# EAGLE design module_r2 (EAGLE 5.11)
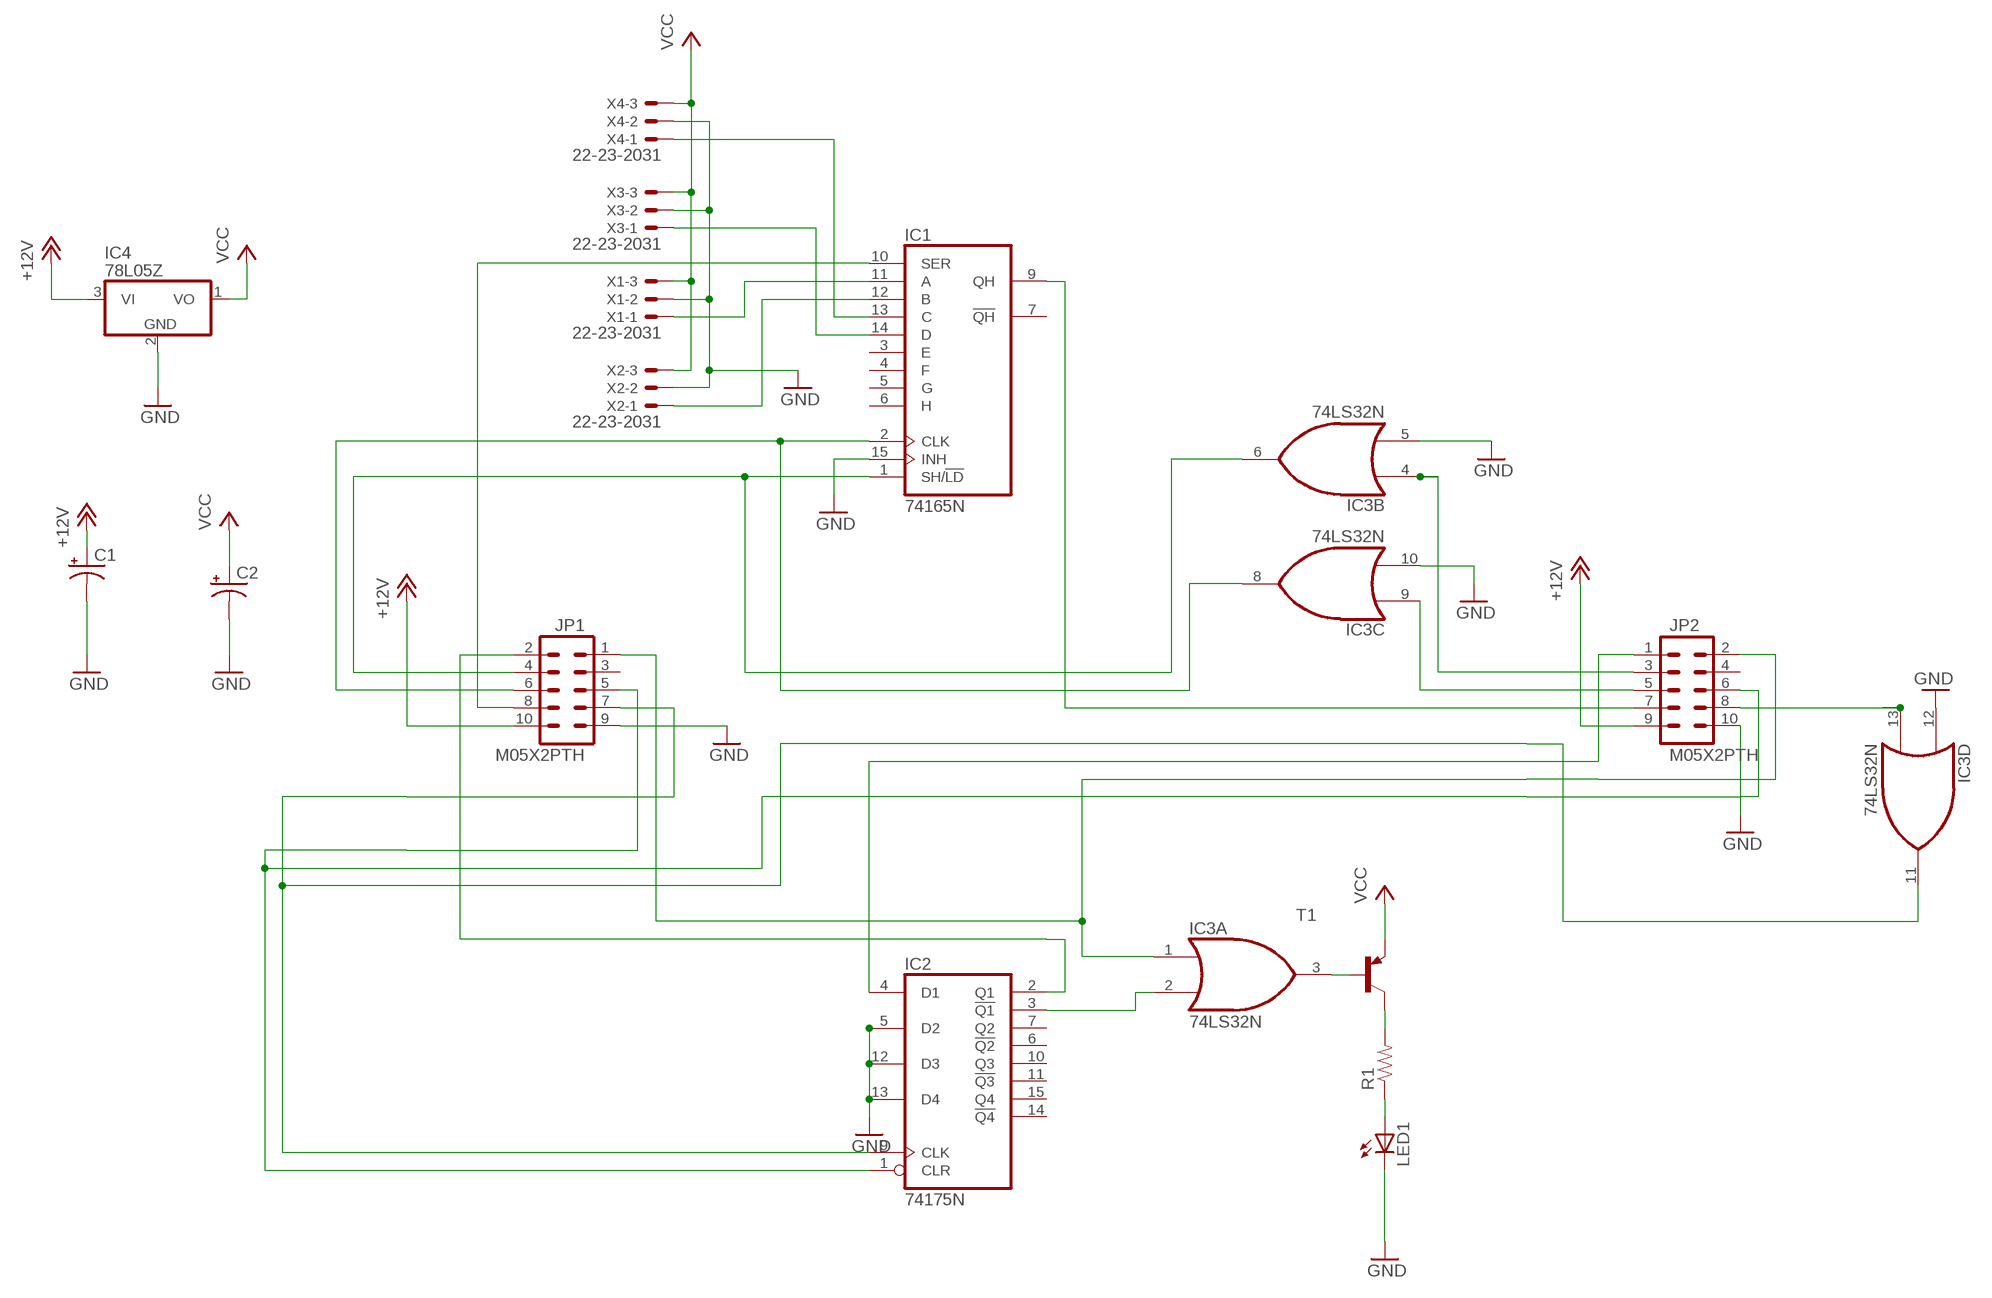
[diagram p0: schematic, sheet 1]

## Parts
C1  CAP_POLPTH2  [CPOL-RADIAL-10UF-25V]
C2  CAP_POLPTH2  [CPOL-RADIAL-10UF-25V]
IC1  74165N  [DIL16]
IC2  74175N  [DIL16]
IC3  74LS32N  [DIL14]
IC4  78L05Z  [TO92]
JP1  M05X2PTH  [AVR_ICSP]
JP2  M05X2PTH  [AVR_ICSP]
LED1  LEDSFH480  [SFH480]
R1  RESISTORPTH-1/6W  [1/6W-RES]
T1  2N3906-PNP-TO92-EBC  [TO92-EBC]
X1  22-23-2031  [22-23-2031]
X2  22-23-2031  [22-23-2031]
X3  22-23-2031  [22-23-2031]
X4  22-23-2031  [22-23-2031]

## Nets
+12V: C1.1(+) IC4.3(VI) JP1.10 JP2.9
GND: C1.2(-) C2.2(-) IC1.15(INH) IC2.5(D2) IC2.12(D3) IC2.13(D4) IC3.5(B:I1) IC3.10(C:I1) IC3.12(D:I0) IC4.2(GND) JP1.9 JP2.10 LED1.K(C) X1.2 X2.2 X3.2 X4.2
N$1: R1.2 T1.C
N$2: IC1.1(SH/!LD) IC3.6(B:O) JP1.4
N$3: IC1.9(QH) JP2.7
N$4: IC1.2(CLK) IC3.8(C:O) JP1.6
N$5: IC3.1(A:I0) JP1.1 JP2.2
N$6: IC3.3(A:O) T1.B
N$7: LED1.A R1.1
N$8: IC1.10(SER) JP1.8
N$9: IC2.1(CLR) JP1.5 JP2.6
N$10: IC2.9(CLK) IC3.11(D:O) JP1.7
N$11: IC1.13(C) X4.1
N$12: IC2.4(D1) JP2.1
N$13: IC1.14(D) X3.1
N$14: IC1.11(A) X1.1
N$15: IC1.12(B) X2.1
N$16: IC2.2(Q1) JP1.2
N$17: IC2.3(!Q1) IC3.2(A:I1)
N$18: IC3.4(B:I0) JP2.3
N$19: IC3.9(C:I0) JP2.5
N$20: IC3.13(D:I1) JP2.8
VCC: C2.1(+) IC4.1(VO) T1.E X1.3 X2.3 X3.3 X4.3
Unconnected: IC1.3(E) IC1.4(F) IC1.5(G) IC1.6(H) IC1.7(!QH) IC2.6(!Q2) IC2.7(Q2) IC2.10(Q3) IC2.11(!Q3) IC2.14(!Q4) IC2.15(Q4) JP1.3 JP2.4

## Power pins joined to a net without a drawn wire
GND: IC1.8(GND) IC2.8(GND) IC3.7(P:GND)
VCC: IC1.16(VCC) IC2.16(VCC) IC3.14(P:VCC)

## Library data of the parts
C1 C2 = SparkFun:CAP_POL: Capacitor Polarized These are standard SMD and PTH capacitors. Normally 10uF, 47uF, and 100uF in electrolytic and tantalum varieties. Always verify the external diameter of the through hole cap, it varies with capacity, voltage, and manufacturer. The EIA devices should be standard.
IC1 = 74xx-us:74*165: 8-bit parallel load SHIFT REGISTER
IC2 = 74xx-us:74*175: Qadruple D type FLIP FLOP, clear
IC3 = 74xx-us:74*32: Quad 2-input OR gate
IC4 = linear:78*: Positive VOLTAGE REGULATOR Source: http://cache.national.com/ds/LM/LM78L05.pdf http://www.fairchildsemi.com/ds/LM/LM7805.pdf
JP1 JP2 = SparkFun:M05X2: Header 5x2 Standard 10-pin dual row 0.1" header. Commonly used with AVR-ISP. Use with Spark Fun Electronics SKU: PRT-00778
LED1 = led:LED: LED OSRAM: - CHIPLED LG R971, LG N971, LY N971, LG Q971, LY Q971, LO R971, LY R971 LH N974, LH R974 LS Q976, LO Q976, LY Q976 LO Q996 - Hyper CHIPLED LW Q18S LB Q993, LB Q99A, LB R99A - SideLED LS A670, LO A670, LY A670, LG A670, LP A670 LB A673, LV A673, LT A673, LW A673 LH A674 LY A675 LS A676, LA A676, LO A676, LY A676, LW A676 LS A679, LY A679, LG A679 - Hyper Micro SIDELED® LS Y876, LA Y876, LO Y876, LY Y876 LT Y87S - SmartLED LW L88C, LW L88S LB L89C, LB L89S, LG L890 LS L89K, LO L89K, LY L89K LS L896, LA L896, LO L896, LY L896 - TOPLED LS T670, LO T670, LY T670, LG T670, LP T670 LSG T670, LSP T670, LSY T670, LOP T670, LYG T670 LG T671, LOG T671, LSG T671 LB T673, LV T673, LT T673, LW T673 LH T674 LS T676, LA T676, LO T676, LY T676, LB T676, LH T676, LSB T676, LW T676 LB T67C, LV T67C, LT T67C, LS T67K, LO T67K, LY T67K, LW E67C LS E67B, LA E67B, LO E67B, LY E67B, LB E67C, LV E67C, LT E67C LW T67C LS T679, LY T679, LG T679 LS T770, LO T770, LY T770, LG T770, LP T770 LB T773, LV T773, LT T773, LW T773 LH T774 LS E675, LA E675, LY E675, LS T675 LS T776, LA T776, LO T776, LY T776, LB T776 LHGB T686 LT T68C, LB T68C - Hyper Mini TOPLED® LB M676 - Mini TOPLED Santana® LG M470 LS M47K, LO M47K, LY M47K Source: http://www.osram.convergy.de LUXEON: - LUMILED® LXK2-PW12-R00, LXK2-PW12-S00, LXK2-PW14-U00, LXK2-PW14-V00 LXK2-PM12-R00, LXK2-PM12-S00, LXK2-PM14-U00 LXK2-PE12-Q00, LXK2-PE12-R00, LXK2-PE12-S00, LXK2-PE14-T00, LXK2-PE14-U00 LXK2-PB12-K00, LXK2-PB12-L00, LXK2-PB12-M00, LXK2-PB14-N00, LXK2-PB14-P00, LXK2-PB14-Q00 LXK2-PR12-L00, LXK2-PR12-M00, LXK2-PR14-Q00, LXK2-PR14-R00 LXK2-PD12-Q00, LXK2-PD12-R00, LXK2-PD12-S00 LXK2-PH12-R00, LXK2-PH12-S00 LXK2-PL12-P00, LXK2-PL12-Q00, LXK2-PL12-R00 Source: www.luxeon.com KINGBRIGHT: KA-3528ASYC Source: www.kingbright.com
R1 = SparkFun:RESISTOR: Resistor Basic schematic elements and footprints for 0603, 1206, and PTH 1/10th watt (small) resistors.
T1 = transistor-neu-to92:*-PNP-: PNP Transistror
X1-X4 = con-molex:22-23-2031: .100" (2.54mm) Center Header - 3 Pin; MF: MOLEX; MPN: 22-23-2031; OC_FARNELL: 1462950; OC_NEWARK: 30C0862

## Board
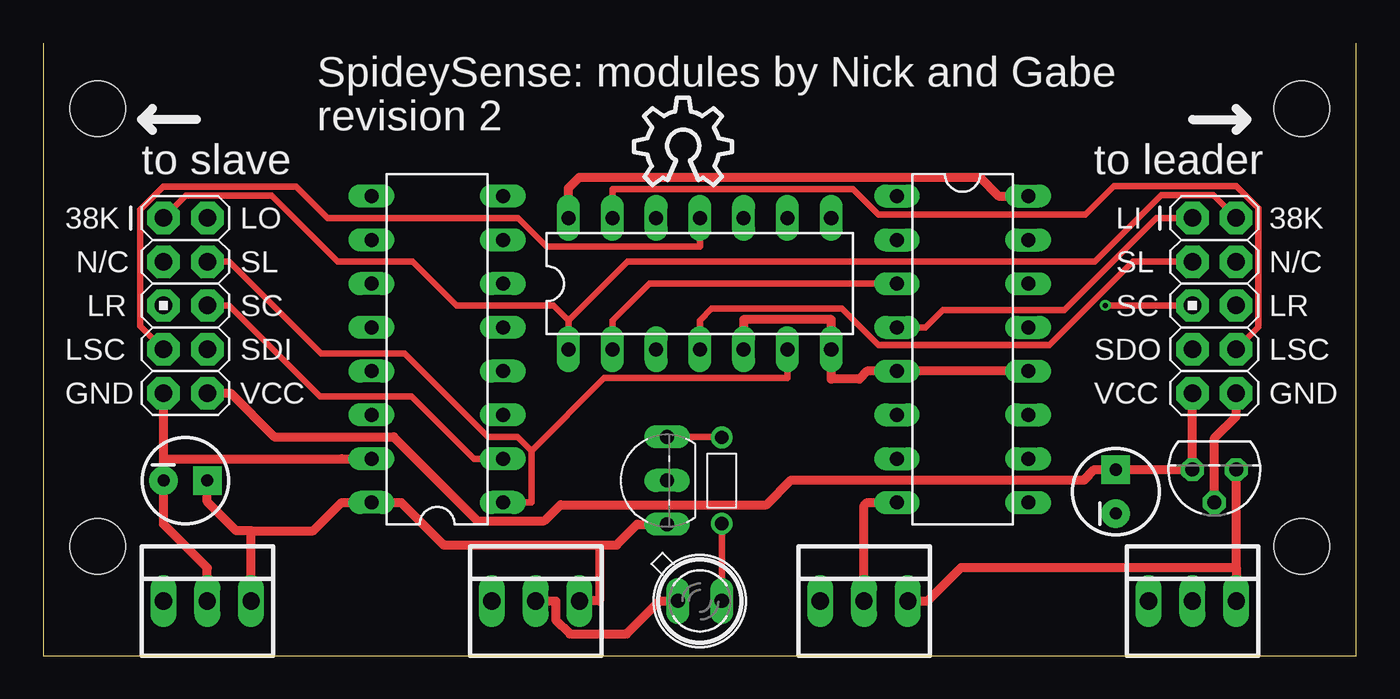
[diagram p1: board, top side]
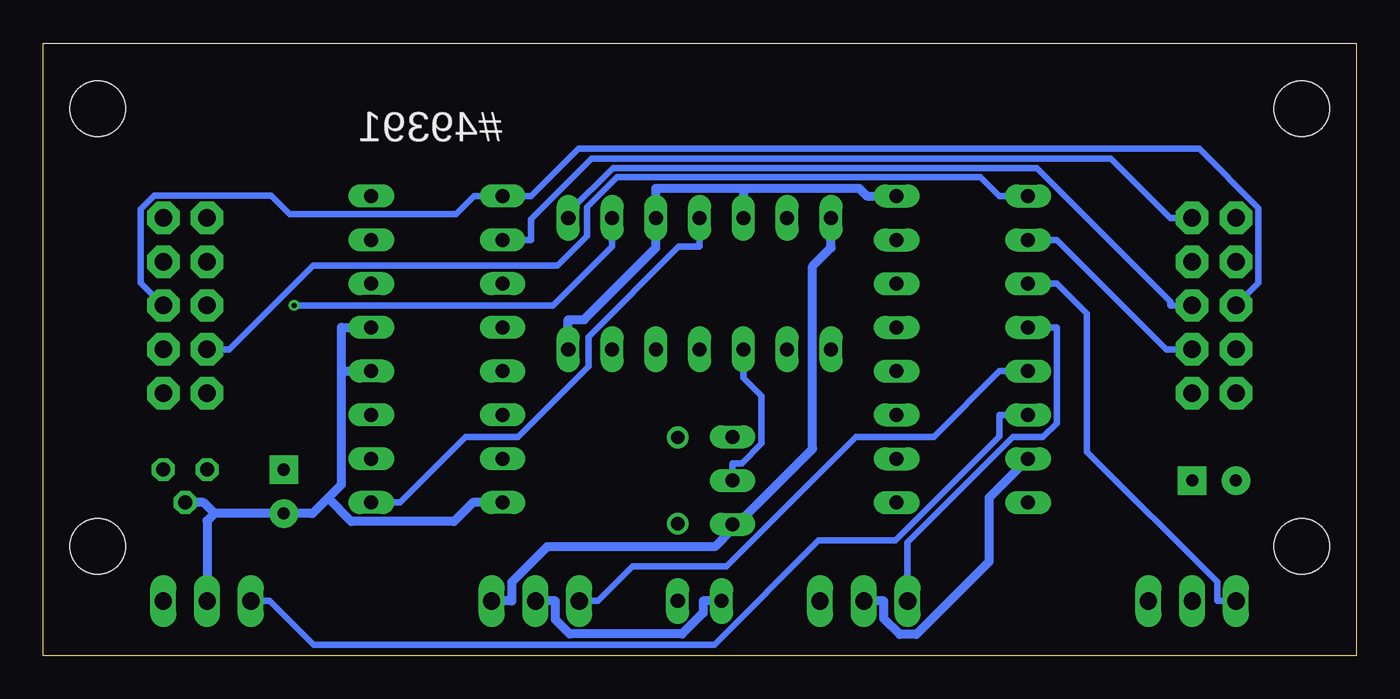
[diagram p2: board, bottom side, seen from below]

Size 76.19 x 35.55 mm. Coordinates in mm from the lower left corner, seen from the top.
Outline: 76.19,35.55 76.19,0 0,0 0,35.55
Copper layers (1*16): Top 0.035mm / dielectric 1.5mm / Bottom 0.035mm
Design rules "Fusion_eagle_rule_v1.1": minimum track width 6mil, minimum drill 12mil, track to track 6mil, track to pad 6mil, pad to pad 6mil, via to via 6mil, smd to smd 0mil, copper to edge 10mil, drill to drill 10mil, minimum pad ring 10mil, minimum via ring 6mil, stop-mask expansion 2mil, vias tented up to drill 100mil, thermal gap 10mil
Holes 3.2 mm at 3.17,6.35 3.17,31.75 73.03,31.75 73.03,6.35

### Footprints (pad centres in the part's own frame; a part is rotated, then mirrored left to right if it is on the bottom)
CPOL-RADIAL-10UF-25V = drill 0.7 pad 1.651 square: 1 1.27,0 | drill 0.7 pad 1.651 round: 2 -1.27,0
DIL16 = drill 0.813 long: 1 -8.89,-3.81; 2 -6.35,-3.81; 3 -3.81,-3.81; 4 -1.27,-3.81; 5 1.27,-3.81; 6 3.81,-3.81; 7 6.35,-3.81; 8 8.89,-3.81; 9 8.89,3.81; 10 6.35,3.81; 11 3.81,3.81; 12 1.27,3.81; 13 -1.27,3.81; 14 -3.81,3.81; 15 -6.35,3.81; 16 -8.89,3.81
DIL14 = drill 0.813 long: 1 -7.62,-3.81; 2 -5.08,-3.81; 3 -2.54,-3.81; 4 0,-3.81; 5 2.54,-3.81; 6 5.08,-3.81; 7 7.62,-3.81; 8 7.62,3.81; 9 5.08,3.81; 10 2.54,3.81; 11 0,3.81; 12 -2.54,3.81; 13 -5.08,3.81; 14 -7.62,3.81
TO92 = drill 0.813 octagon: 1 -1.27,0; 2 0,1.905; 3 1.27,0
AVR_ICSP = drill 1.016 pad 1.88 octagon: 1 -1.27,5.08; 2 1.27,5.08; 3 -1.27,2.54; 4 1.27,2.54; 5 -1.27,0; 6 1.27,0; 7 -1.27,-2.54; 8 1.27,-2.54; 9 -1.27,-5.08; 10 1.27,-5.08
SFH480 = drill 0.813 long: A 1.27,0; K -1.27,0
1/6W-RES = drill 0.762 round: 1 -2.5,0; 2 2.5,0
TO92-EBC = drill 0.813 long: B 0,-1.27; C 2.54,-1.27; E -2.54,-1.27
22-23-2031 = drill 1 long: 1 -2.54,0; 2 0,0; 3 2.54,0

### Placement (x,y rotation side)
C1  62.23,9.53 90 top
C2  8.26,10.16 0 top
IC1  22.86,17.78 90 top
IC2  53.34,17.78 270 top
IC3  38.1,21.59 0 top
IC4  67.94,10.79 180 top
JP1  8.26,20.32 0 top
JP2  67.94,20.32 0 top
LED1  38.1,3.17 0 top
R1  39.37,10.16 90 top
T1  34.92,10.16 90 top
U$1  [OSHW_10X200_NOTEXT]  34.29,27.3 0 top
X1  9.53,3.17 0 top
X2  28.57,3.17 0 top
X3  66.67,3.17 0 top
X4  47.62,3.17 0 top

### Tracks (layer width: path | path; a pad name or v marks a point on that pad's centre or on a via)
+12V
  Top 0.508: JP2.9 IC4.3 63.46,10.79 C1.1 61,10.79 60.39,10.19 43.4,10.19 41.97,8.76 30.02,8.76 29.09,7.82 25.21,7.82 20.34,12.7 13.41,12.7 10.87,15.24 JP1.10
GND
  Top 0.508: JP2.10 69.22,13.89 67.94,12.62 IC4.2 | IC2.8 47.8,8.89 47.62,8.71 X4.2 | IC2.12 IC2.5 47.8,16.51 47.34,16.05 45.72,16.05 IC3.7 45.72,19.51 40.64,19.51 IC3.5 | X2.2 29.73,3.17 29.73,2.09 30.56,1.26 33.85,1.26 35.76,3.17 LED1.K | 6.99,11.43 C2.2 6.99,7.63 9.53,5.09 X1.2 | 6.99,11.43 6.99,13.89 JP1.9 | 6.99,11.43 17.32,11.43 IC1.15
  Bottom 0.508: IC1.8 28.4,26.67 28.86,27.13 35.56,27.13 | 35.56,27.13 35.56,26.96 IC3.12 | X2.2 27.41,3.17 27.41,2.15 26.49,1.23 25.54,1.23 21.31,5.46 21.31,9.17 IC1.15 | IC3.7 45.72,19.51 44.8,19.51 40.64,23.67 IC3.10 40.64,27.13 35.56,27.13 | 59.66,9.15 60.55,8.26 C1.2 66.24,8.26 | 58.88,16.51 58.88,9.93 59.66,9.15 | 59.66,9.15 58.3,7.79 52.36,7.79 51.26,8.89 IC2.8 | 66.24,8.26 66.88,8.89 IC4.2 | X3.2 66.67,7.82 66.24,8.26 | LED1.K 37.9,3.17 37.9,2.48 39.11,1.26 45.64,1.26 46.47,2.09 46.47,3.17 X4.2 | IC2.13 58.88,19.05 58.88,16.51 | 58.88,16.51 IC2.12
N$1
  Top 0.381: T1.C 39.33,12.7 R1.2
N$2
  Top 0.381: IC3.6 43.18,16.12 32.55,16.12 28.33,11.89 | 28.33,11.89 28.33,8.89 IC1.1 | 28.33,11.89 27.53,12.7 25.81,12.7 20.98,17.53 16.14,17.53 10.81,22.86 JP1.4
N$3
  Bottom 0.381: IC1.9 20.71,26.67 21.81,27.76 42.91,27.76 44.64,26.03 44.64,24.36 46.35,22.64 60.53,22.64 65.39,17.78 JP2.7
N$4
  Top 0.381: IC1.2 25.01,11.43 21.39,15.05 16.08,15.05 10.81,20.32 JP1.6
  Bottom 0.381: JP1.6 10.81,20.32 10.81,20.56 18.55,28.3 43.13,28.3 45.72,25.7 IC3.8
N$5
  Top 0.381: 30.48,19.44 33.9,22.86 61.02,22.86 64.88,26.72 67.9,26.72 JP2.2 | JP1.1 8.27,26.68 13.26,26.68 17.08,22.86 21.45,22.86 23.99,20.32 29.6,20.32 30.48,19.44 | 30.48,19.44 IC3.1
N$6
  Bottom 0.381: IC3.3 35.56,16.12 34.5,15.06 34.5,12.31 35.65,11.16 36.2,11.16 T1.B
N$7
  Top 0.381: LED1.A R1.1
N$8
  Bottom 0.381: IC1.10 17.39,24.13 11.04,17.78 JP1.8
N$9
  Bottom 0.381: JP1.5 5.69,21.62 5.69,25.98 9.13,29.42 45.12,29.42 47.87,26.67 IC2.1 51.19,26.67 52.23,25.64 61.87,25.64 62.94,26.71 69.74,26.71 70.53,25.92 70.53,21.64 JP2.6
N$10
  Top 0.381: IC3.11 38.1,23.74 29.21,23.74 27.55,25.4 16.5,25.4 14.68,27.22 6.97,27.22 5.64,25.89 5.64,19.13 JP1.7
  Bottom 0.381: IC2.9 55.49,8.89 51.68,12.7 48.64,12.7 44.55,16.78 44.55,18.49 39.31,23.74 38.1,23.74 IC3.11
N$11
  Bottom 0.381: IC1.13 20.71,16.51 24.52,12.7 29.02,12.7 36.54,5.18 41.98,5.18 43.99,3.17 X4.1
N$12
  Top 0.381: JP2.1 65.39,25.4 64.58,25.4 59.23,20.05 52.2,20.05 51.19,19.05 IC2.4
N$13
  Bottom 0.381: IC1.14 20.71,13.97 20.71,12.73 26.75,6.69 31.2,6.69 37.25,0.64 60.51,0.64 63.04,3.17 X3.1
N$14
  Bottom 0.381: IC1.11 17.39,21.59 15.64,19.84 15.64,11.83 8.08,4.27 8.08,3.17 X1.1
N$15
  Bottom 0.381: X2.1 26.04,6.58 19.91,12.7 18.18,12.7 17.39,13.49 17.39,19.05 IC1.12
N$16
  Bottom 0.381: IC2.2 47.87,24.13 47.87,25.34 44.38,28.83 14.24,28.83 10.81,25.4 JP1.2
N$17
  Top 0.381: IC3.2 33.02,19.44 35.17,21.59 IC2.3
N$18
  Top 0.381: JP2.3 63.21,22.86 58.36,18.02 48.45,18.02 46.34,20.13 38.79,20.13 38.1,19.44 IC3.4
N$19  (via drill 0.3 pad 0.61)
  Top 0.381: v61.62,20.32 JP2.5
  Bottom 0.381: v61.62,20.32 46.6,20.32 43.18,23.74 IC3.9
N$20
  Top 0.381: IC3.13 33.02,27.06 46.99,27.06 48.46,25.6 60.47,25.6 62.13,27.25 69.22,27.25 70.51,25.96 70.51,19.07 JP2.8
VCC
  Top 0.508: IC2.16 55.42,26.67 54.33,27.76 31.11,27.76 30.48,27.13 IC3.14 | 32.28,6.43 23.24,6.43 20.78,8.89 IC1.16 17.32,8.89 15.68,7.24 12.06,7.24 | 32.28,6.43 33.28,6.43 34.47,7.62 T1.E | 32.28,6.43 32.28,3.17 X2.3 | 12.06,7.24 11.21,7.24 9.53,8.93 C2.1 | X1.3 12.06,7.24 | 69.22,5.12 X3.3 | 69.22,5.12 IC4.1 | 69.22,5.12 53.27,5.12 51.33,3.17 X4.3
  Bottom 0.508: X4.3 49.01,3.17 49.01,4.26 46.94,6.33 37.22,6.33 36.2,7.35 | IC3.14 30.48,23.67 31.55,22.61 31.55,12 36.2,7.35 | T1.E 36.2,7.35

### Text on the board
_tsilk: SpideySense: modules by Nick and Gabe | revision 2 | to slave | to leader | 38K | LO | LI | 38K | N/C | SL | SL | N/C | LR | SC | SC | LR | LSC | SDI | SDO | LSC | GND | VCC | VCC | GND
_bsilk: #49391